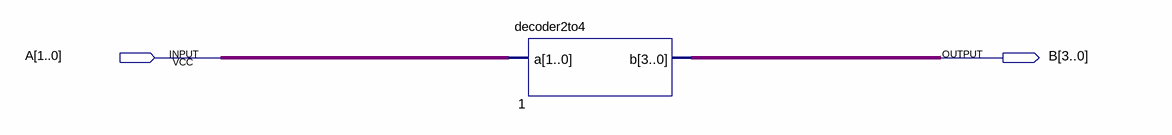
[diagram p0: schematic sheet]
// Quartus schematic Decoder.bdf as structural Verilog: 1 symbols, 2 pins
module Decoder (
  input  [1:0] A,
  output [3:0] B
);

  decoder2to4 u_1 (.a(A), .b(B));
endmodule
